# Altium project MacroPlay.PrjPcb
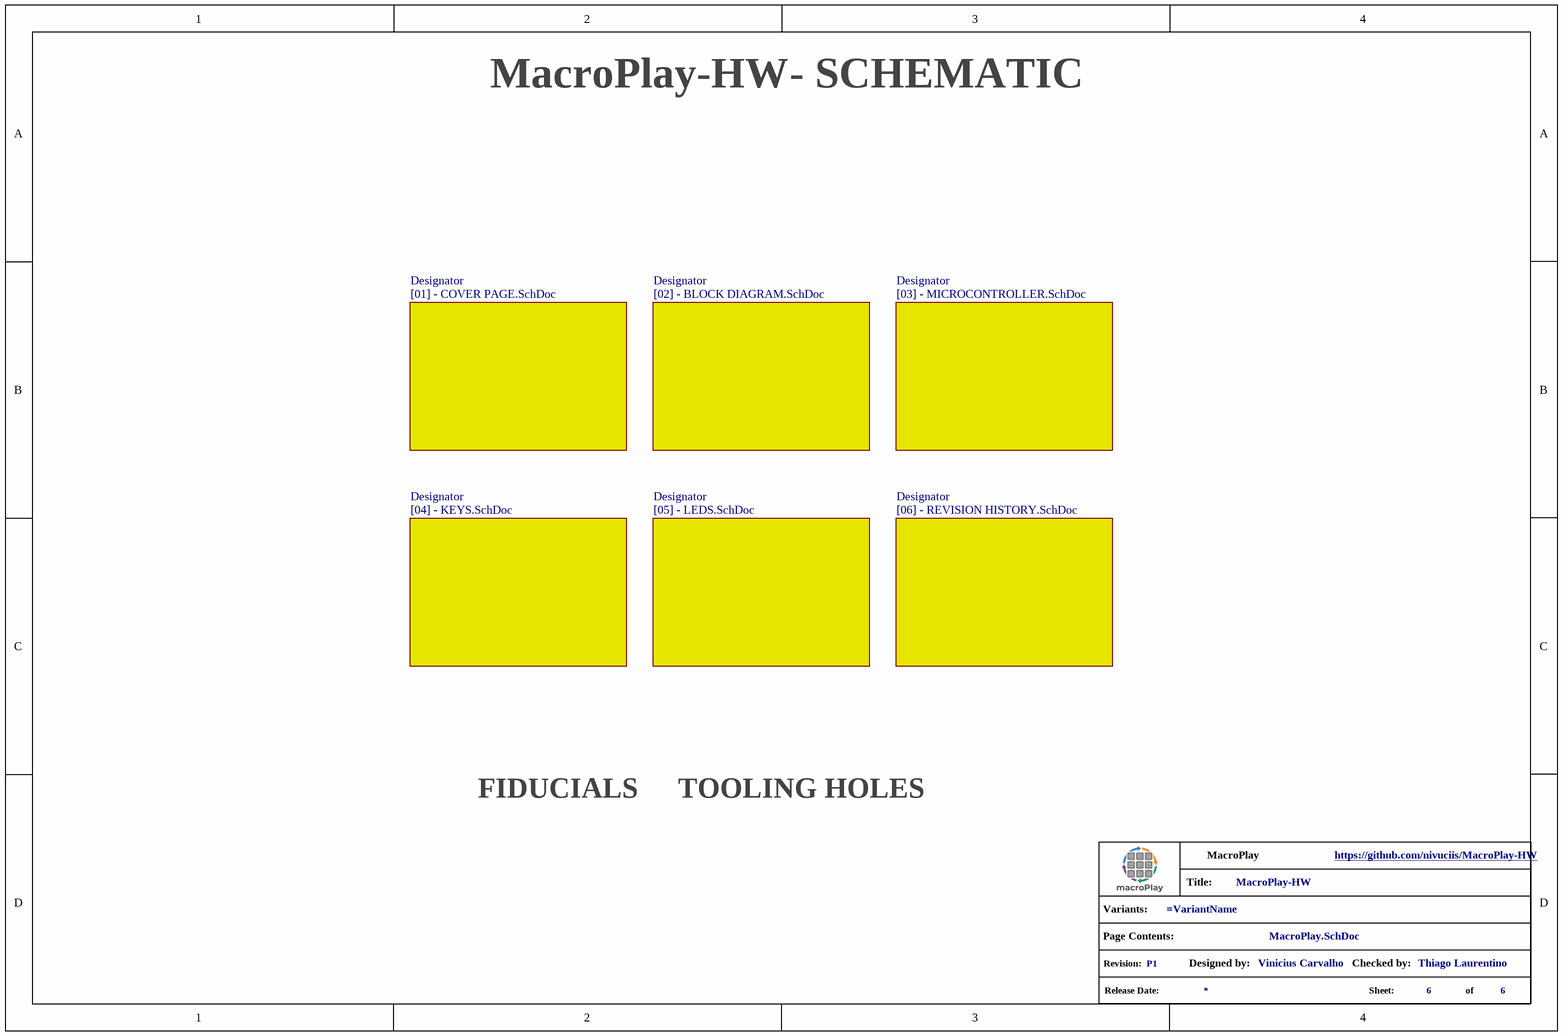
[diagram p0: MacroPlay.SchDoc]
Website: https://github.com/nivuciis/MacroPlay-HW; VersionRevision: P1; TitleProject: MacroPlay-HW; DesignedProject: Vinicius Carvalho; Company: MacroPlay; CheckedProject: Thiago Laurentino
7 sheets, 88 parts. Net scope: flat (ports and power ports of the same name join across sheets).
Board file: MacroPlay.PcbDoc
Sheets:
  MacroPlay.SchDoc
    Designator = [02] - BLOCK DIAGRAM.SchDoc
    Designator = [03] - MICROCONTROLLER.SchDoc
    Designator = [01] - COVER PAGE.SchDoc
    Designator = [06] - REVISION HISTORY.SchDoc
    Designator = [04] - KEYS.SchDoc
    Designator = [05] - LEDS.SchDoc

## Sheet MacroPlay.SchDoc
size A4; DocumentNumber: 6; SheetNumber: 6; SheetTotal: 6

### Parts
(Parts that share a designator on the sheet are numbered #1, #2 ... from top to bottom, then left to right.)
*?#1  info_project  (value not drawn)  (graphical)

### Sub-sheets
Designator = [02] - BLOCK DIAGRAM.SchDoc: no entries
Designator = [03] - MICROCONTROLLER.SchDoc: no entries
Designator = [01] - COVER PAGE.SchDoc: no entries
Designator = [06] - REVISION HISTORY.SchDoc: no entries
Designator = [04] - KEYS.SchDoc: no entries
Designator = [05] - LEDS.SchDoc: no entries

### Notes on the sheet
- - SCHEMATIC
- FIDUCIALS
- TOOLING HOLES
- (in symbol info_project) Title:; Variants:; Page Contents:; Revision:; Designed by:; Checked by:; Release Date:; Sheet:; of

### Library data of the parts
*?#1 = info_project: GRAPHICAL - Info Project

## Sheet [02] - BLOCK DIAGRAM.SchDoc
size A2; DocumentNumber: 2; SheetNumber: 2; SheetTotal: 6; PageSetup: Record=PageOptions|CenterHorizontal=True|CenterVertical=True|PrintScale=0.52|XCorrection=1.00|YCorrection=1.00|PrintKind=1|BorderSize=5000000|LeftOffset=0|BottomOffset=0|Orientation=2|PaperLength=1000|PaperWidth=1000|Scale=100|PaperSource=4|PrintQuality=600|MediaType=1|DitherType=10|PrintScaleMode=1|PaperKind=A4|PaperIndex=9
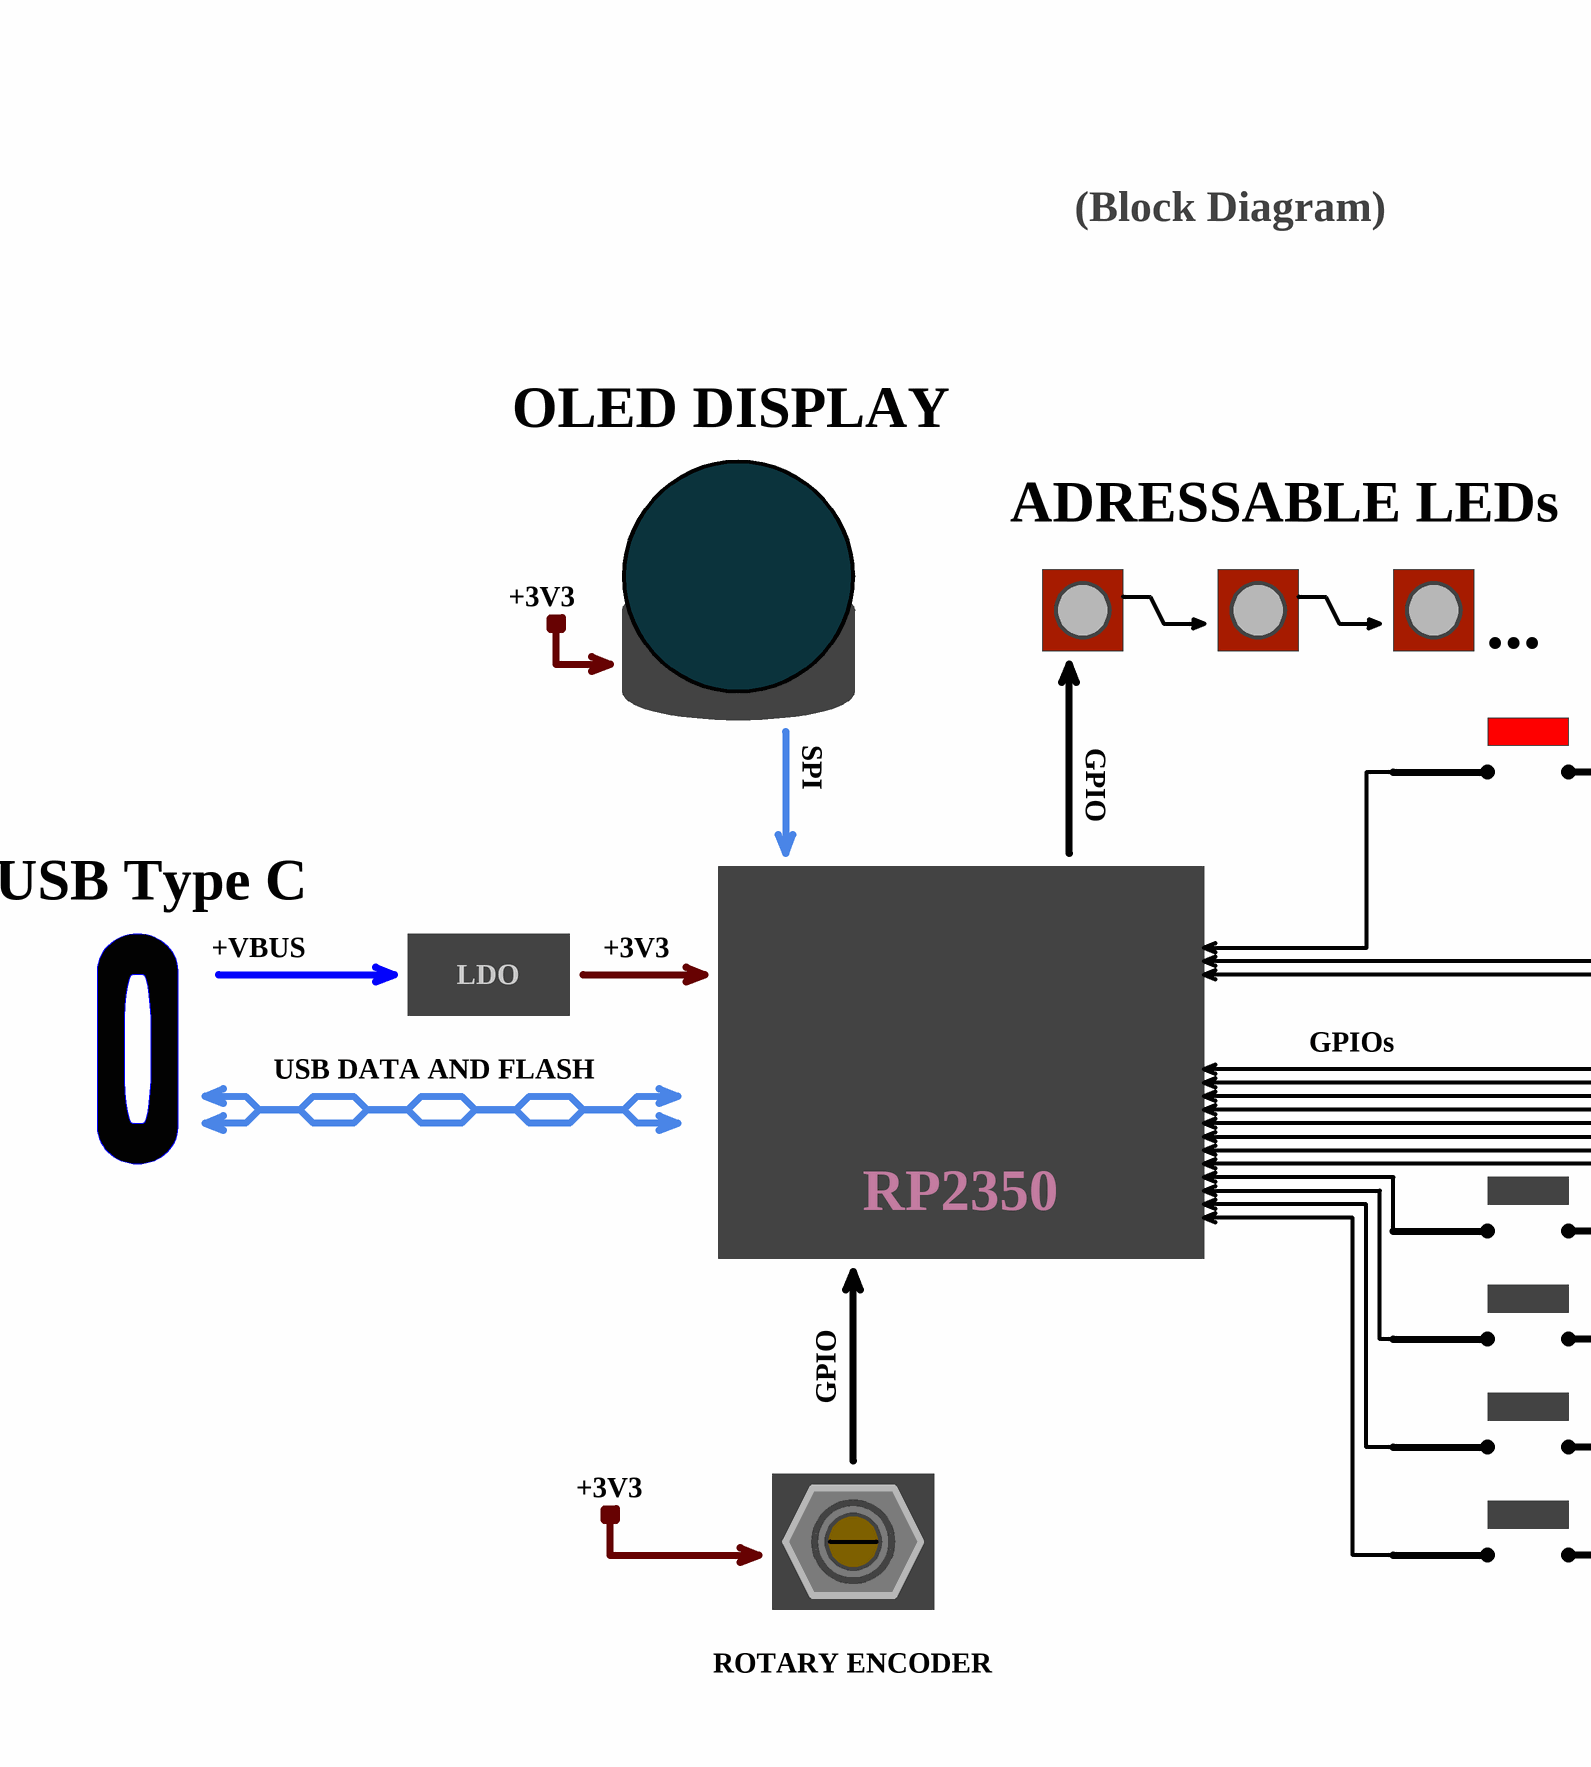
[diagram p1: [02] - BLOCK DIAGRAM.SchDoc, left]
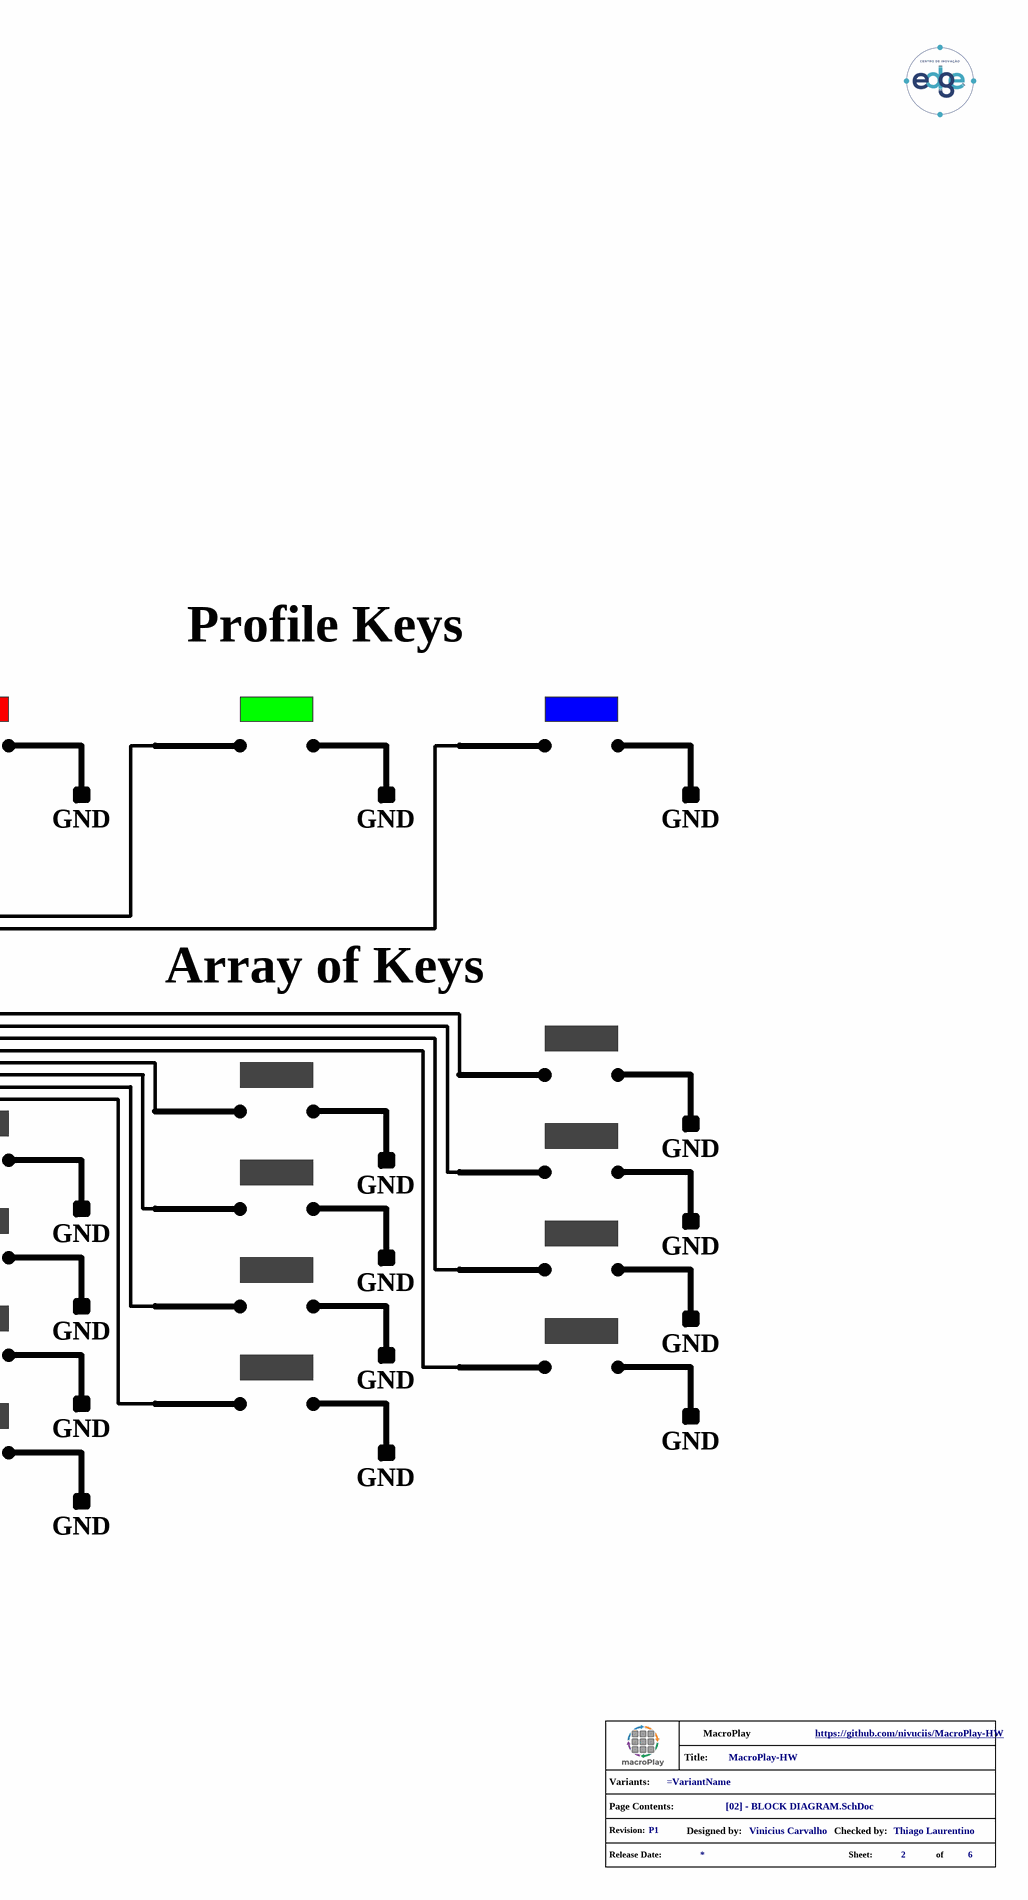
[diagram p2: [02] - BLOCK DIAGRAM.SchDoc, right]

### Parts
(Parts that share a designator on the sheet are numbered #1, #2 ... from top to bottom, then left to right.)
*?#2  info_project  (value not drawn)  (graphical)

### Notes on the sheet
- (Block Diagram)
- OLED DISPLAY
- ADRESSABLE LEDs
- +3V3
- ...
- Profile Keys
- SPI
- GPIO
- GND
- USB Type C
- +VBUS
- LDO
- USB DATA AND FLASH
- GPIOs
- Array of Keys
- RP2350
- ROTARY ENCODER
- (in symbol info_project) Title:; Variants:; Page Contents:; Revision:; Designed by:; Checked by:; Release Date:; Sheet:; of

### Library data of the parts
*?#2 = info_project: GRAPHICAL - Info Project

## Sheet [03] - MICROCONTROLLER.SchDoc
size A4; DocumentNumber: 3; SheetNumber: 3; SheetTotal: 6
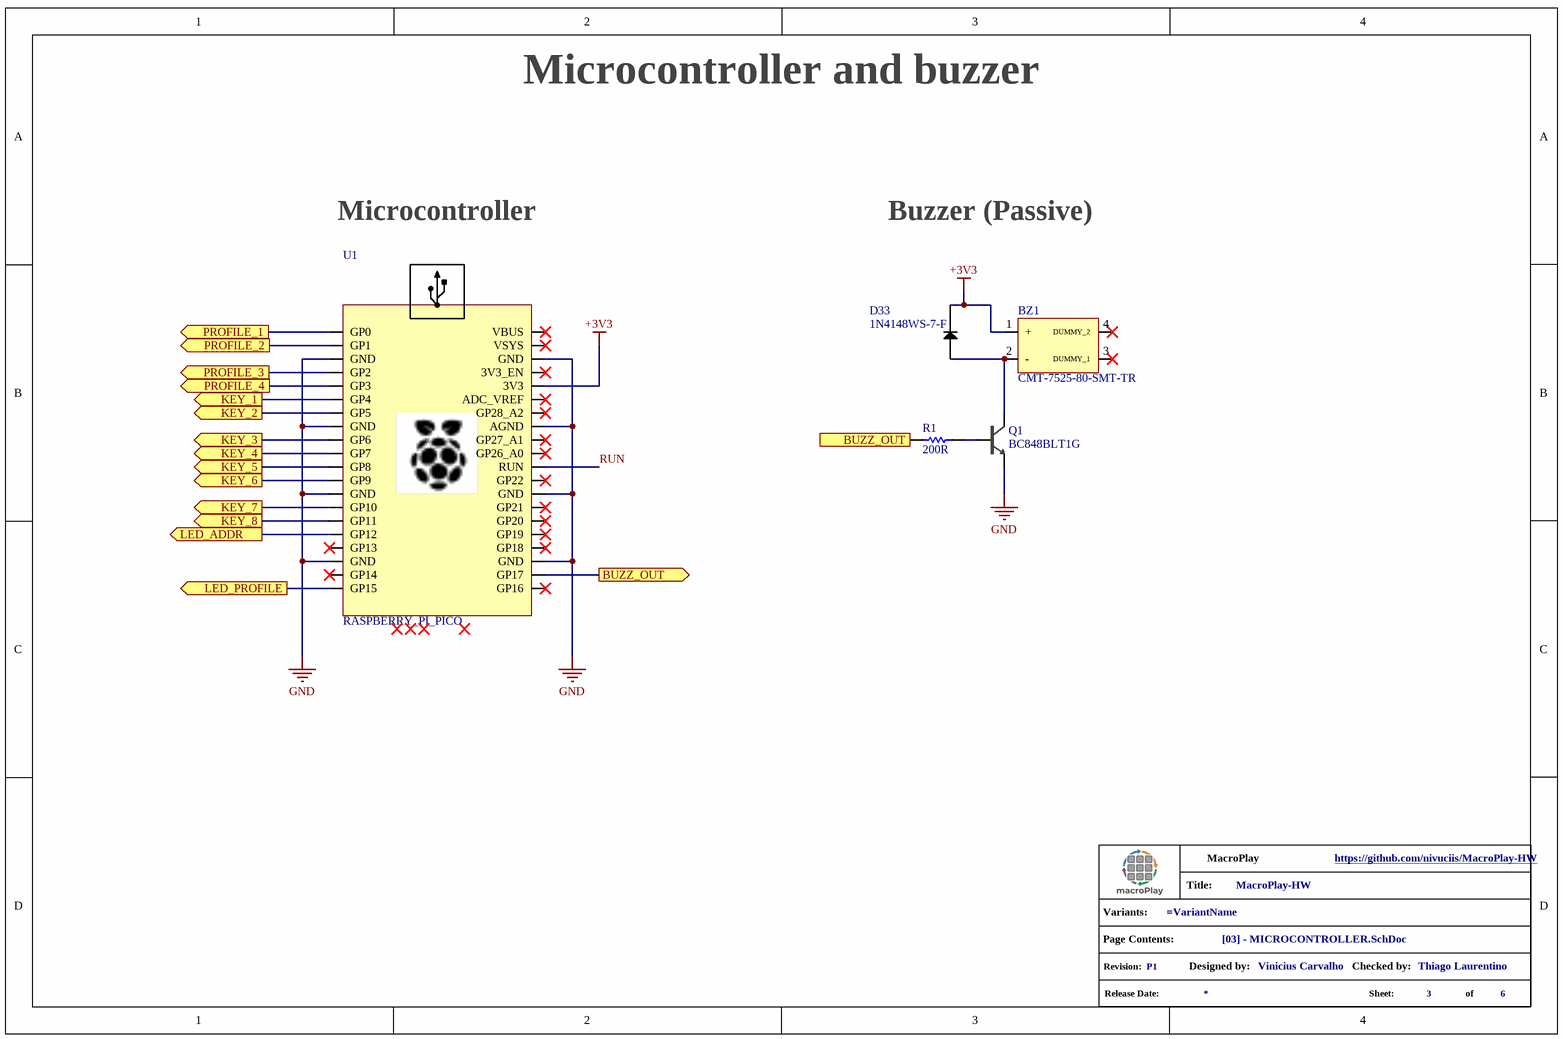
[diagram p3: [03] - MICROCONTROLLER.SchDoc]

### Parts
(Parts that share a designator on the sheet are numbered #1, #2 ... from top to bottom, then left to right.)
*?#3  info_project  (value not drawn)  (graphical)
BZ1  CMT-7525-80-SMT-TR  [CMT752580SMTTR]
D33  1N4148WS-7-F  [SOD2513X120N]
Q1  BC848BLT1G  [SOT-23-3]
R1  200R  [R0402 - IronSolder]
U1  RASPBERRY_PI_PICO  [RASPBERRY_PI_PICO]

### Ports
BUZZ_OUT (in), BUZZ_OUT (out), KEY_1 (out), KEY_2 (out), KEY_3 (out), KEY_4 (out), KEY_5 (out), KEY_6 (out), KEY_7 (out), KEY_8 (out), LED_ADDR (out), LED_PROFILE (out), PROFILE_1 (out), PROFILE_2 (out), PROFILE_3 (out), PROFILE_4 (out)

### Nets
+3V3: BZ1.1(+) D33.1 U1.3V3
GND: Q1.2(Emitter) U1.AGND U1.GND
RUN: U1.RUN
NetBZ1_2: BZ1.2(-) D33.2 Q1.3(Collector)
NetD1#2_4: U1.GP12 ; port LED_ADDR
NetQ1_1: Q1.1(Base) R1.2
NetR1_1: R1.1 U1.GP17 ; port BUZZ_OUT
NetR2_2: U1.GP0 ; port PROFILE_1
NetR3_2: U1.GP1 ; port PROFILE_2
NetR4_2: U1.GP2 ; port PROFILE_3
NetR5_2: U1.GP3 ; port PROFILE_4
NetR6_2: U1.GP4 ; port KEY_1
NetR7_2: U1.GP5 ; port KEY_2
NetR8_2: U1.GP6 ; port KEY_3
NetR9_2: U1.GP7 ; port KEY_4
NetR10_2: U1.GP8 ; port KEY_5
NetR11_2: U1.GP9 ; port KEY_6
NetR12_2: U1.GP10 ; port KEY_7
NetR13_2: U1.GP11 ; port KEY_8
NetU1_GP15: U1.GP15 ; port LED_PROFILE

Not connected (* = marked no-connect by the designer): BZ1 3(DUMMY_1)* 4(DUMMY_2)*; U1 3V3_EN* ADC_VREF* GP13* GP14* GP16* GP18* GP19* GP20* GP21* GP22* GP26_A0* GP27_A1* GP28_A2* VBUS* VSYS*

### Notes on the sheet
- Microcontroller and buzzer
- Microcontroller
- Buzzer (Passive)
- (in symbol info_project) Title:; Variants:; Page Contents:; Revision:; Designed by:; Checked by:; Release Date:; Sheet:; of

### Library data of the parts
*?#3 = info_project: GRAPHICAL - Info Project
BZ1 = CMT-7525-80-SMT-TR: BUZZER - Buzzers Transducer, Externally Driven Magnetic 3.6 V 100mA 2.73kHz 80dB @ 3.6V, 10cm Surface Mount Solder Pads; Manufacturer_Name: Same Sky; Datasheet Link: https://www.sameskydevices.com/product/resource/CMT-7525-80-SMT-TR.pdf; Height: 2.7mm; Manufacturer_Part_Number: CMT-7525-80-SMT-TR; Mouser Part Number: 490-CMT-7525-80SMTTR; Mouser Price/Stock: https://www.mouser.co.uk/ProductDetail/Same-Sky/CMT-7525-80-SMT-TR?qs=P1JMDcb91o5izP7Xira9ww%3D%3D; Arrow Part Number: CMT-7525-80-SMT-TR; Arrow Price/Stock: https://www.arrow.com/en/products/cmt-7525-80-smt-tr/cui-devices?region=nac
D33 = 1N4148WS-7-F: DIODE - Diode 75 V 150mA Surface Mount SOD-323; Manufacturer_Name: Diodes Incorporated; Datasheet Link: https://www.diodes.com//assets/Datasheets/1N4148WS_BAV16WS.pdf; Height: 1.2mm; Manufacturer_Part_Number: 1N4148WS-7-F; Mouser Part Number: 621-1N4148WS-F; Mouser Price/Stock: https://www.mouser.co.uk/ProductDetail/Diodes-Incorporated/1N4148WS-7-F?qs=4drIV0IxA0r8aNy7%2Fu4kVw%3D%3D; Arrow Part Number: 1N4148WS-7-F; Arrow Price/Stock: https://www.arrow.com/en/products/1n4148ws-7-f/diodes-incorporated?utm_currency=USD&region=europe
Q1 = BC848BLT1G: TRANS - NPN 30V 100mA 300mW SOT23-3.; Manufacturer 1: ON Semiconductor; Emitter Base Voltage (VEBO): 5V; Collector Emitter Saturation Voltage: 600mV; Transition Frequency: 100MHz; hFE Min: 200; Number of Elements: 1; Description 1: NPN Ic=100mA Vceo=30V hfe=200~450 P=225mW SOT-23; Category 1: BJTs; .Mounting: SMT; .PCBChecked: Lucas Vieira; Case/Package: SOT-23-3; Pins: 3; Contact Plating: Tin,Matte; Min Operating Temperature: -55°C; Max Operating Temperature: 150°C; Packaging: Tape and Reel; Polarity: NPN; Collector Emitter Breakdown Voltage: 30V; Max Power Dissipation: 300mW; Package Quantity: 3000; Collector Base Voltage (VCBO): 30V; Max Collector Current: 100mA; Max Breakdown Voltage: 30V; Power Dissipation: 300mW; Clock Frequency: 100MHz; Voltage Rating (DC): 30V; Current Rating: 100mA; Collector-emitter Voltage-Max: 600mV; Series: -; Collector Emitter Voltage (VCEO): 30V; Frequency: 100MHz; Gain Bandwidth Product: 100MHz; Length: 2.9mm; Width: 1.3mm; Height: 0.94mm; Radiation Hardening: No; Lead Free: Lead Free; Reach SVHC Compliant: No; RoHS Compliant: Yes; ComponentLink1URL: https://datasheet.ciiva.com/15139/getdatasheetpartid-87781-15139134.pdf?src-supplier=Verical; ComponentLink1Description: https://datasheet.ciiva.com/15139/getdatasheetpartid-87781-15139134.pdf?src-supplier=Verical; ComponentLink2URL: https://datasheet.ciiva.com/7971/bc846alt1-d-7971962.pdf?src-supplier=Element14; ComponentLink2Description: https://datasheet.ciiva.com/7971/bc846alt1-d-7971962.pdf?src-supplier=Element14; ComponentLink3URL: https://datasheet.ciiva.com/7971/bc846alt1-d-7971960.pdf?src-supplier=Element14; ComponentLink3Description: https://datasheet.ciiva.com/7971/bc846alt1-d-7971960.pdf?src-supplier=Element14; ComponentLink4URL: https://datasheet.ciiva.com/11204/bc846alt1-d-11204358.pdf?src-supplier=Avnet; ComponentLink4Description: https://datasheet.ciiva.com/11204/bc846alt1-d-11204358.pdf?src-supplier=Avnet; ComponentLink5URL: https://datasheet.ciiva.com/11198/bc846alt1-d-11198026.pdf?src-supplier=Avnet; ComponentLink5Description: https://datasheet.ciiva.com/11198/bc846alt1-d-11198026.pdf?src-supplier=Avnet; ComponentLink6URL: https://datasheet.ciiva.com/976/bc846alt1-d-976387.pdf?src-supplier=Digi-Key; ComponentLink6Description: https://datasheet.ciiva.com/976/bc846alt1-d-976387.pdf?src-supplier=Digi-Key; ComponentLink7URL: https://datasheet.ciiva.com/976/bc846alt1-d-976388.pdf?src-supplier=Digi-Key; ComponentLink7Description: https://datasheet.ciiva.com/976/bc846alt1-d-976388.pdf?src-supplier=Digi-Key; ComponentLink8URL: https://datasheet.ciiva.com/976/bc846alt1-d-976386.pdf?src-supplier=Digi-Key; ComponentLink8Description: https://datasheet.ciiva.com/976/bc846alt1-d-976386.pdf?src-supplier=Digi-Key; Supplier 1: Digi-Key; Supplier Part Number 1: BC848BLT1GOSCT-ND; Manufacturer Part Number 1: BC848BLT1G; RoHS 1: Yes; Stock 1: 199953; Pricing 1: 1=0,14, 10=0,131, 100=0,0712, 500=0,04384, 1000=0,02989 (USD); Manufacturer 2: ON Semiconductor; Manufacturer Part Number 2: SBC848BLT1G; Manufacturer 3: Nexperia USA Inc.; Manufacturer Part Number 3: BC848B,215; .SCHChecked: Lucas Vieira
R1 = RT0402BRD07200RL: RES - 200R  0.0625W 0402 0.1%  50V Fixed Resistor, Thin Film; Manufacturer 1: Yageo; Additional Feature: HIGH PRECISION; Power: 62.5mW; Rated Temperature: 70°C; Temperature Coefficient (ppm/Cel): 25; Package Height: 0.3mm; Package Length: 1mm; Package Width: 0.5mm; .Mounting: SMT; Supplier: Avnet; Supplier Part Number: 49AK4062; RoHS: Yes; Category: Chip SMD Resistors; Stock: 8493; Pricing: 1=0,198, 25=0,135, 100=0,098, 250=0,087, 500=0,077 (USD); Mounting Technology: Surface Mount; Pins: 2; Case/Package: 0402; Min Operating Temperature: -55°C; Max Operating Temperature: 155°C; Tolerance: 0.1%; Resistor Type: FIXED RESISTOR; Construction: Chip; Packaging: Tape and Reel; Value: 200R; Technology: THIN FILM; Termination: Wraparound; Working Voltage: 50V; Reach SVHC Compliant: Yes; RoHS Compliant: Yes; ComponentLink1URL: https://datasheet.ciiva.com:443/pdfs/VipMasterIC/IC/YAGO/YAGO-S-A0008510989/YAGO-S-A0008510989-1.pdf?src-supplier=IHS+Markit; ComponentLink1Description: https://datasheet.ciiva.com:443/pdfs/VipMasterIC/IC/YAGO/YAGO-S-A0008510989/YAGO-S-A0008510989-1.pdf?src-supplier=IHS+Markit; ComponentLink2URL: https://datasheet.ciiva.com/12705/pyu-rt-1-to-0-05-rohs-l-4-12705967.pdf?src-supplier=Mouser; ComponentLink2Description: https://datasheet.ciiva.com/12705/pyu-rt-1-to-0-05-rohs-l-4-12705967.pdf?src-supplier=Mouser; ComponentLink3URL: https://datasheet.ciiva.com/46635/pyu-rt-1-to-0-05-rohs-l-5-46635174.pdf?src-supplier=Digikey; ComponentLink3Description: https://datasheet.ciiva.com/46635/pyu-rt-1-to-0-05-rohs-l-5-46635174.pdf?src-supplier=Digikey; ComponentLink4URL: https://datasheet.ciiva.com/2582/pyu-rt-1-to-0-05-rohs-l-4-2582220.pdf?src-supplier=Digikey; ComponentLink4Description: https://datasheet.ciiva.com/2582/pyu-rt-1-to-0-05-rohs-l-4-2582220.pdf?src-supplier=Digikey; .SCHChecked: *; .PCBChecked: *; Manufacturer Part Number 1: RT0402BRD07200RL
U1 = RASPBERRY_PI_PICO: MCU Module - Raspberry Pi Board, Arm Cortex-M0+; Core Architecture:Arm; Core Sub-Architecture:Cortex-M0+; Kit Contents:Raspberry Pi Pico Board; No. Of Bits:32Bit; Silicon Core Number:Rp2040; Silicon Manufacturer:Raspberry Pi |Raspberry-Pi RASPBERRY PI PICO; .Mounting: SMD or PTH variant; SnapEDA_Link: https://www.snapeda.com/parts/RASPBERRY%20PI%20PICO/Raspberry+Pi/view-part/?ref=snap; Package: None; Value: *; MF: Raspberry Pi; MP: RASPBERRY PI PICO; Check_prices: https://www.snapeda.com/parts/RASPBERRY%20PI%20PICO/Raspberry+Pi/view-part/?ref=eda; .PCBChecked: *; .SCHChecked: *

## Sheet [01] - COVER PAGE.SchDoc
size A3; DocumentNumber: 1; SheetNumber: 1; SheetTotal: 6
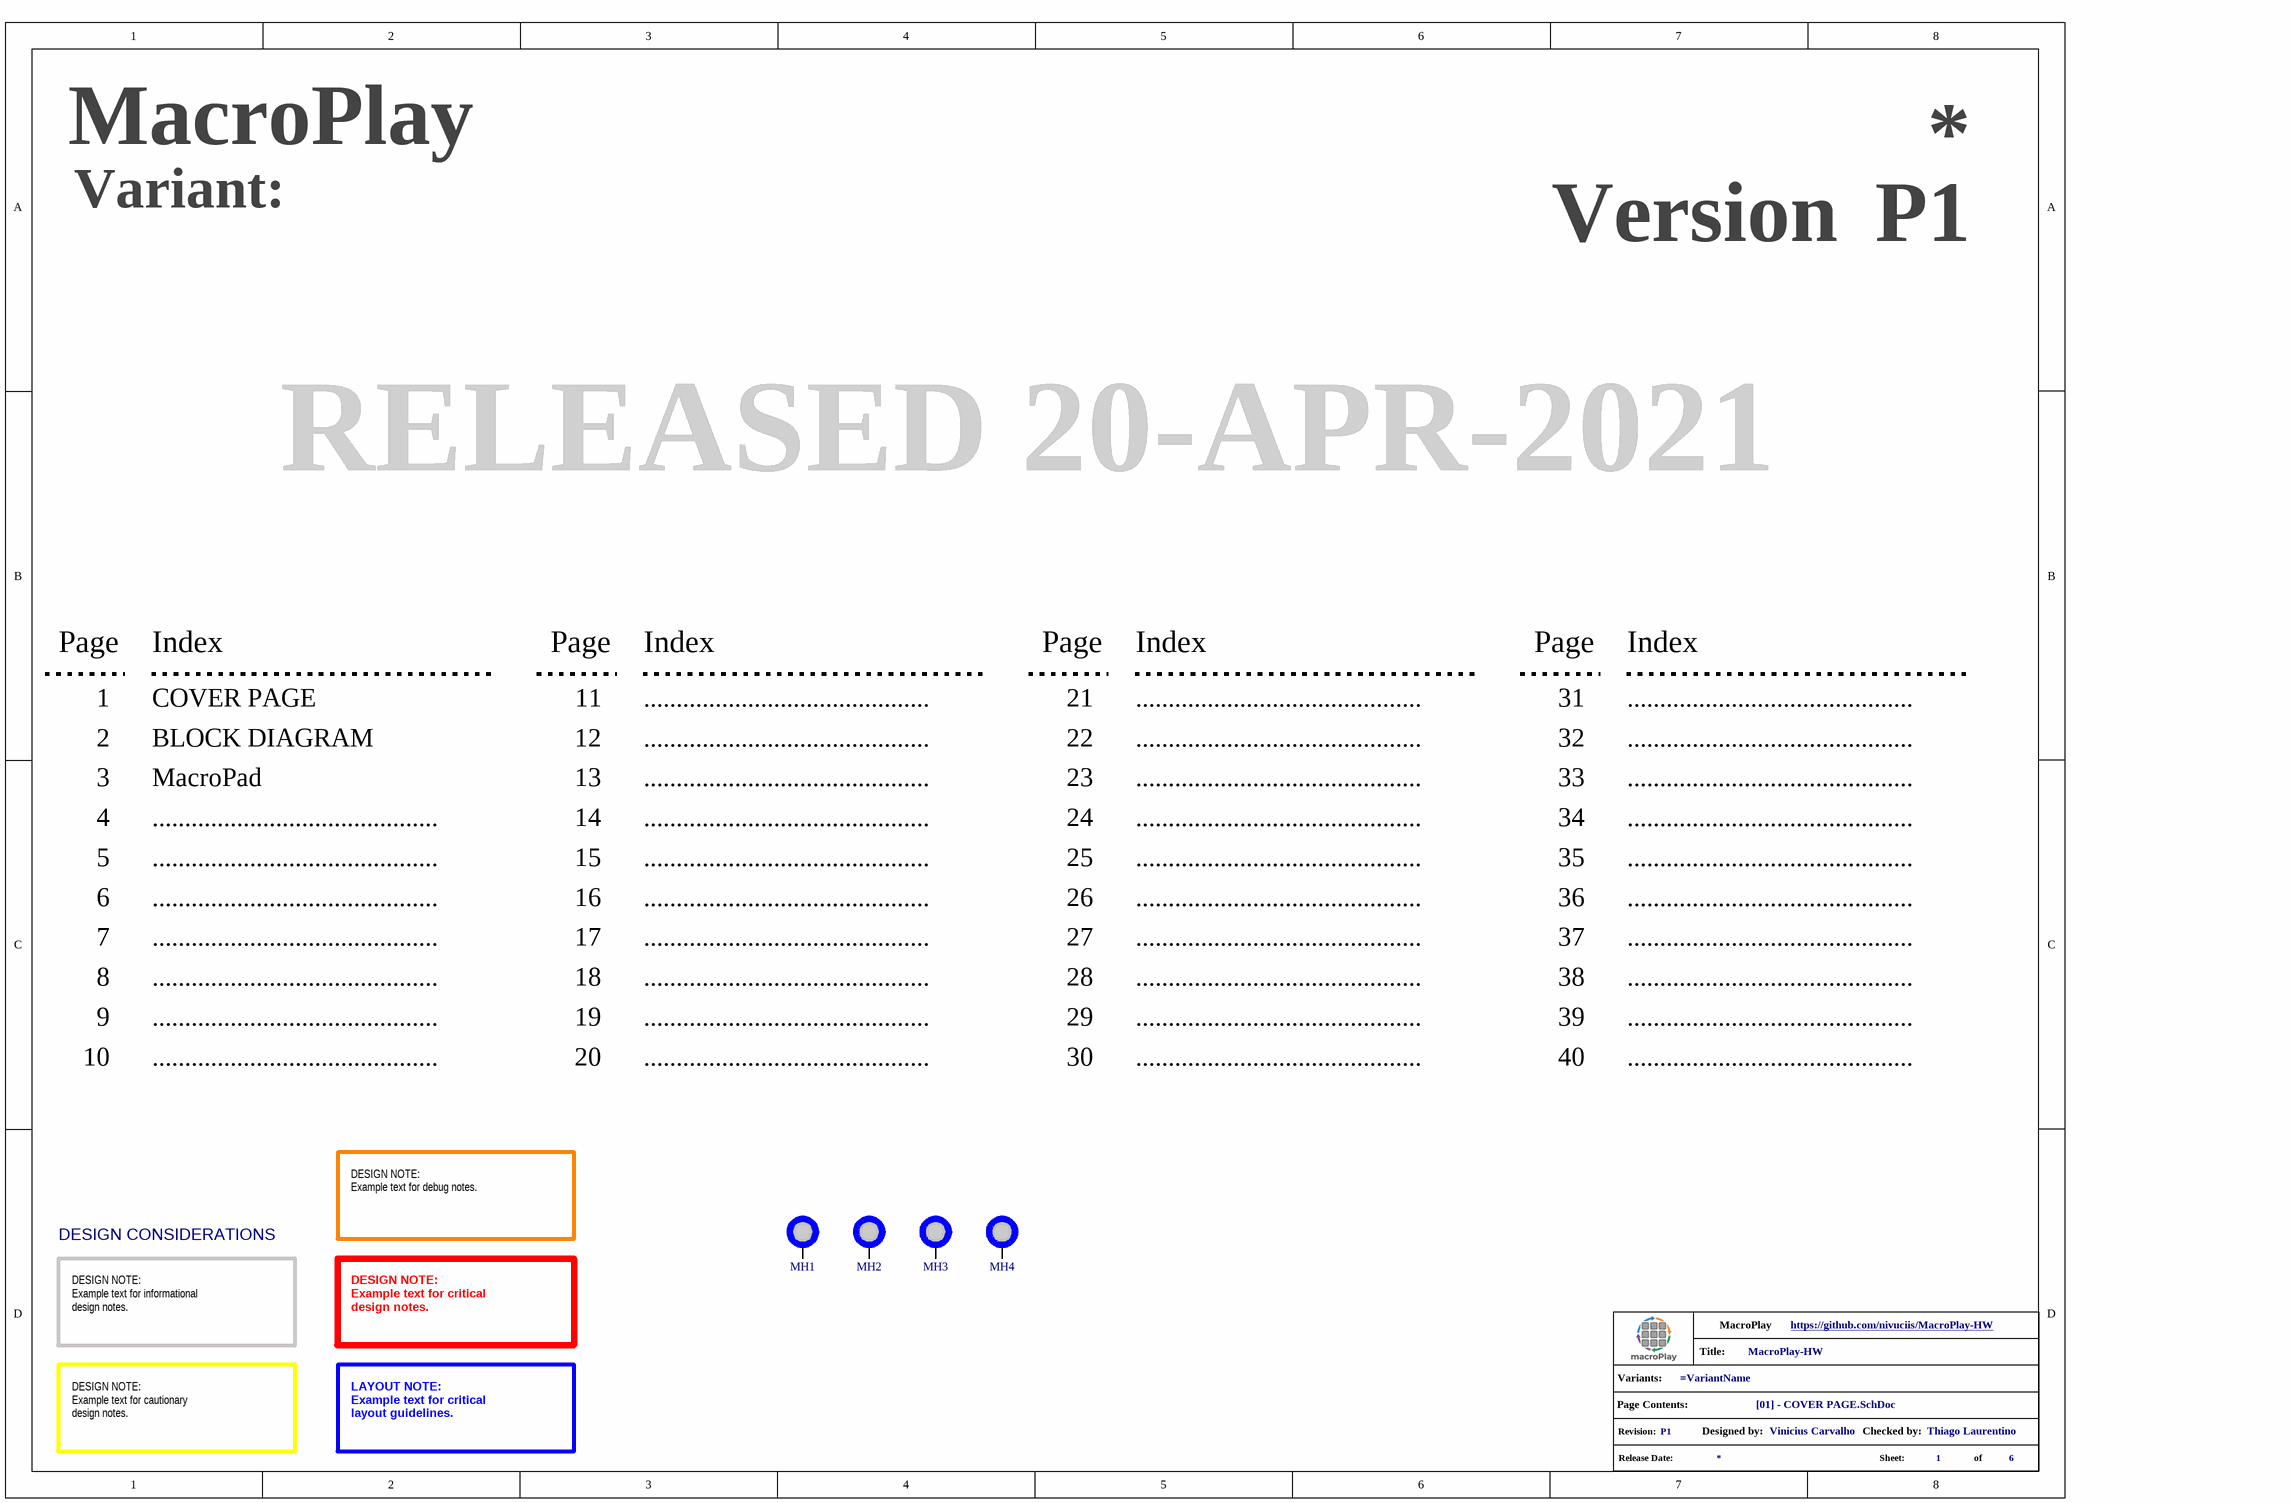
[diagram p4: [01] - COVER PAGE.SchDoc]

### Parts
(Parts that share a designator on the sheet are numbered #1, #2 ... from top to bottom, then left to right.)
*?#4  info_project  (value not drawn)  (graphical)
MH1  MH_7.4MMC_3.2MMD  [MH_7.4MMC_3.2MMD]  (value not drawn)
MH2  MH_7.4MMC_3.2MMD  [MH_7.4MMC_3.2MMD]  (value not drawn)
MH3  MH_7.4MMC_3.2MMD  [MH_7.4MMC_3.2MMD]  (value not drawn)
MH4  MH_7.4MMC_3.2MMD  [MH_7.4MMC_3.2MMD]  (value not drawn)

### Nets

Not connected (* = marked no-connect by the designer): MH1 1; MH2 1; MH3 1; MH4 1

### Notes on the sheet
- MacroPlay
- Variant:
- Version
- RELEASED 20-APR-2021
- Page
- Index
- 1
- COVER PAGE
- 11
- ............................................
- 21
- 31
- 2
- 3
- BLOCK DIAGRAM
- MacroPad
- 12
- 13
- 22
- 23
- 32
- 33
- 4
- 14
- 24
- 34
- 5
- 6
- 15
- 16
- 25
- 26
- 35
- 36
- 7
- 8
- 17
- 18
- 27
- 28
- 37
- 38
- 9
- 19
- 29
- 39
- 10
- 20
- 30
- 40
- DESIGN CONSIDERATIONS
- DESIGN NOTE:
  Example text for debug notes.
- DESIGN NOTE:
  Example text for informational
  design notes.
- DESIGN NOTE:
  Example text for critical
  design notes.
- DESIGN NOTE:
  Example text for cautionary
  design notes.
- LAYOUT NOTE:
  Example text for critical
  layout guidelines.
- (in symbol info_project) Title:; Variants:; Page Contents:; Revision:; Designed by:; Checked by:; Release Date:; Sheet:; of

### Library data of the parts
*?#4 = info_project: GRAPHICAL - Info Project
MH1-MH4 = MH_7.4MMC_3.2MMD: Mounting Hole 7.4mm Diameter 3.2mm Drill

## Sheet [06] - REVISION HISTORY.SchDoc
size A3; DocumentNumber: 5; SheetNumber: 5; SheetTotal: 6
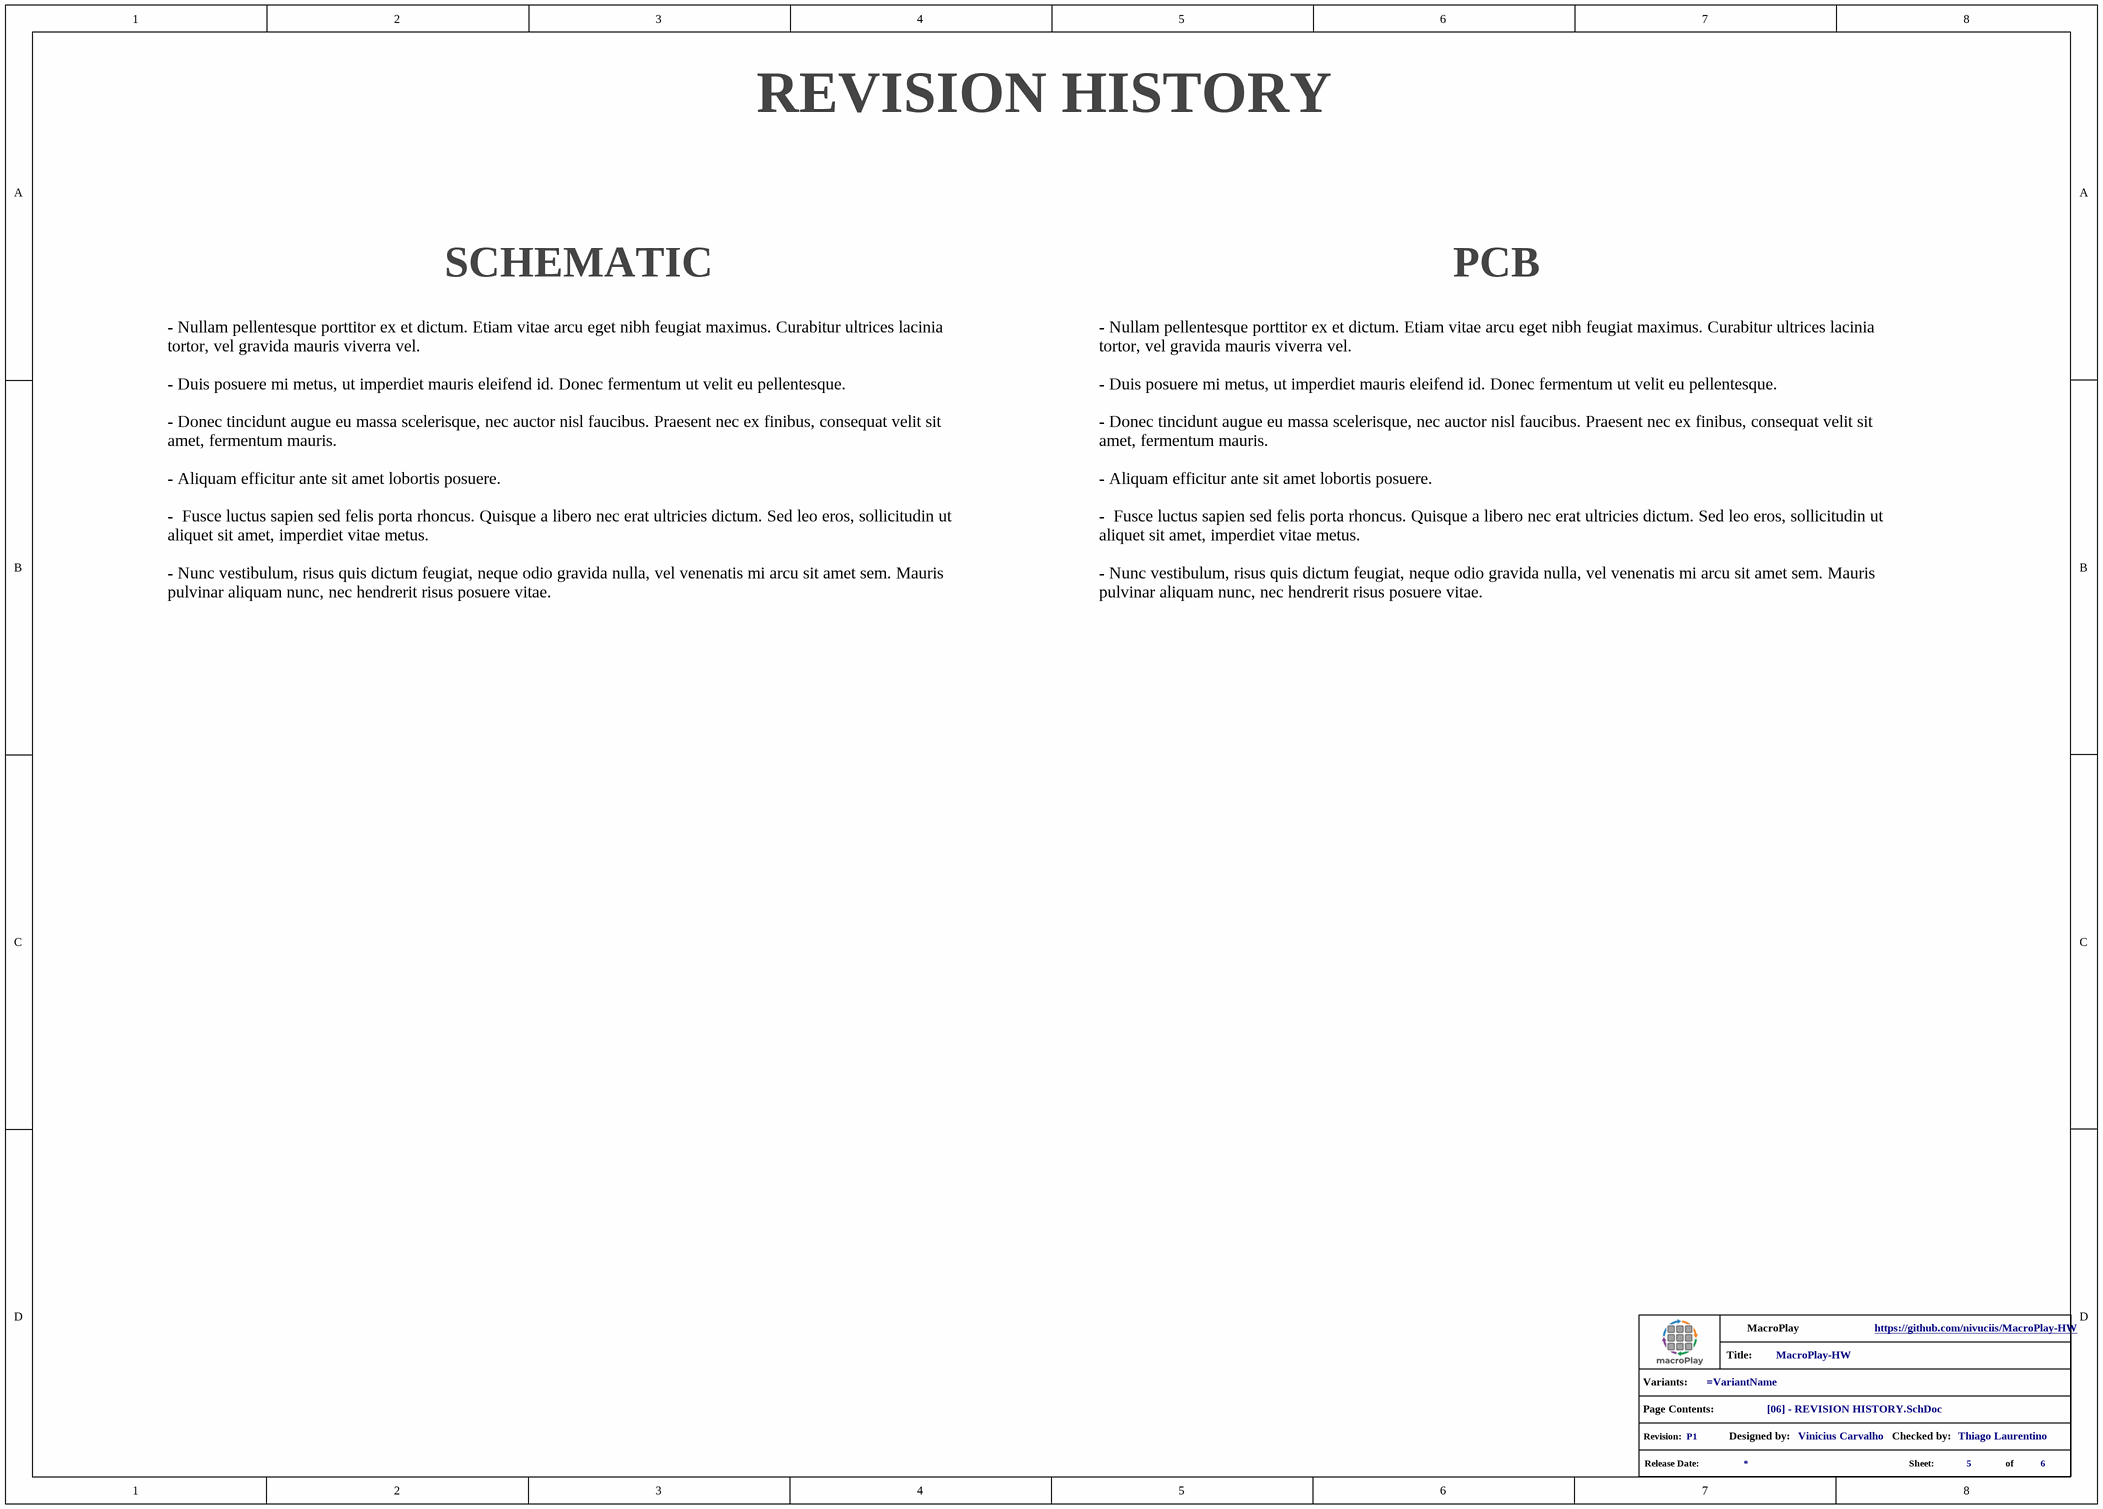
[diagram p5: [06] - REVISION HISTORY.SchDoc]

### Parts
*  info_project  (value not drawn)  (graphical)

### Notes on the sheet
- REVISION HISTORY
- SCHEMATIC
- PCB
- - Nullam pellentesque porttitor ex et dictum. Etiam vitae arcu eget nibh feugiat maximus. Curabitur ultrices lacinia tortor, vel gravida mauris viverra vel.
  - Duis posuere mi metus, ut imperdiet mauris eleifend id. Donec fermentum ut velit eu pellentesque.
  - Donec tincidunt augue eu massa scelerisque, nec auctor nisl faucibus. Praesent nec ex finibus, consequat velit sit amet, fermentum mauris.
  - Aliquam efficitur ante sit amet lobortis posuere.
  -  Fusce luctus sapien sed felis porta rhoncus. Quisque a libero nec erat ultricies dictum. Sed leo eros, sollicitudin ut aliquet sit amet, imperdiet vitae metus.
  - Nunc vestibulum, risus quis dictum feugiat, neque odio gravida nulla, vel venenatis mi arcu sit amet sem. Mauris pulvinar aliquam nunc, nec hendrerit risus posuere vitae.
- (in symbol info_project) Title:; Variants:; Page Contents:; Revision:; Designed by:; Checked by:; Release Date:; Sheet:; of

### Library data of the parts
* = info_project: GRAPHICAL - Info Project

## Sheet [04] - KEYS.SchDoc
size A4
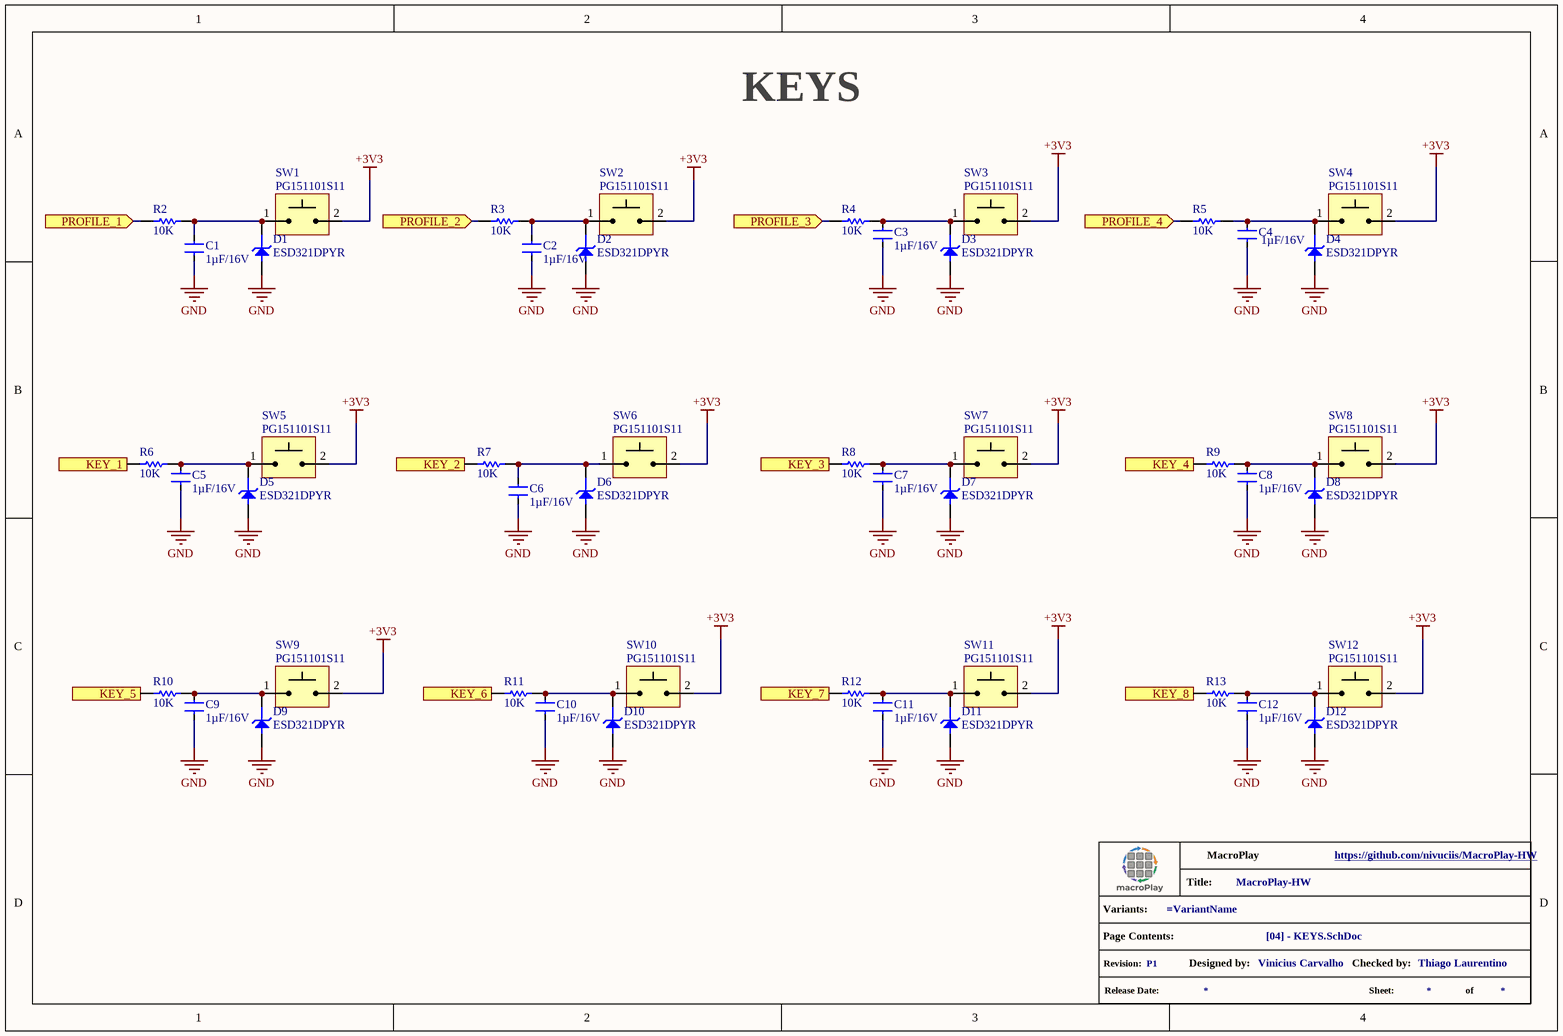
[diagram p6: [04] - KEYS.SchDoc]

### Parts
(Parts that share a designator on the sheet are numbered #1, #2 ... from top to bottom, then left to right.)
C1  1µF/16V  [C0402 - Iron Soldering]
C2  1µF/16V  [C0402 - Iron Soldering]
C3  1µF/16V  [C0402 - Iron Soldering]
C4  1µF/16V  [C0402 - Iron Soldering]
C5  1µF/16V  [C0402 - Iron Soldering]
C6  1µF/16V  [C0402 - Iron Soldering]
C7  1µF/16V  [C0402 - Iron Soldering]
C8  1µF/16V  [C0402 - Iron Soldering]
C9  1µF/16V  [C0402 - Iron Soldering]
C10  1µF/16V  [C0402 - Iron Soldering]
C11  1µF/16V  [C0402 - Iron Soldering]
C12  1µF/16V  [C0402 - Iron Soldering]
D1#1  ESD321DPYR  [ESD321DPYR]
D2#1  ESD321DPYR  [ESD321DPYR]
D3#1  ESD321DPYR  [ESD321DPYR]
D4#1  ESD321DPYR  [ESD321DPYR]
D5#1  ESD321DPYR  [ESD321DPYR]
D6#1  ESD321DPYR  [ESD321DPYR]
D7#1  ESD321DPYR  [ESD321DPYR]
D8#1  ESD321DPYR  [ESD321DPYR]
D9#1  ESD321DPYR  [ESD321DPYR]
D10#1  ESD321DPYR  [ESD321DPYR]
D11#1  ESD321DPYR  [ESD321DPYR]
D12#1  ESD321DPYR  [ESD321DPYR]
GPH?#1  info_project  (value not drawn)  (graphical)
R2  10K  [R0402 - IronSolder]
R3  10K  [R0402 - IronSolder]
R4  10K  [R0402 - IronSolder]
R5  10K  [R0402 - IronSolder]
R6  10K  [R0402 - IronSolder]
R7  10K  [R0402 - IronSolder]
R8  10K  [R0402 - IronSolder]
R9  10K  [R0402 - IronSolder]
R10  10K  [R0402 - IronSolder]
R11  10K  [R0402 - IronSolder]
R12  10K  [R0402 - IronSolder]
R13  10K  [R0402 - IronSolder]
SW1  PG151101S11  [SW_PG151101S11]
SW2  PG151101S11  [SW_PG151101S11]
SW3  PG151101S11  [SW_PG151101S11]
SW4  PG151101S11  [SW_PG151101S11]
SW5  PG151101S11  [SW_PG151101S11]
SW6  PG151101S11  [SW_PG151101S11]
SW7  PG151101S11  [SW_PG151101S11]
SW8  PG151101S11  [SW_PG151101S11]
SW9  PG151101S11  [SW_PG151101S11]
SW10  PG151101S11  [SW_PG151101S11]
SW11  PG151101S11  [SW_PG151101S11]
SW12  PG151101S11  [SW_PG151101S11]

### Ports
KEY_1 (in), KEY_2 (in), KEY_3 (in), KEY_4 (in), KEY_5 (in), KEY_6 (in), KEY_7 (in), KEY_8 (in), PROFILE_1 (in), PROFILE_2 (in), PROFILE_3 (in), PROFILE_4 (in)

### Nets
+3V3: SW1.2 SW2.2 SW3.2 SW4.2 SW5.2 SW6.2 SW7.2 SW8.2 SW9.2 SW10.2 SW11.2 SW12.2
GND: C1.1 C2.1 C3.1 C4.1 C5.1 C6.1 C7.1 C8.1 C9.1 C10.1 C11.1 C12.1 D1#1.2 D2#1.2 D3#1.2 D4#1.2 D5#1.2 D6#1.2 D7#1.2 D8#1.2 D9#1.2 D10#1.2 D11#1.2 D12#1.2
NetC1_2: C1.2 D1#1.1 R2.1 SW1.1
NetC2_2: C2.2 D2#1.1 R3.1 SW2.1
NetC3_2: C3.2 D3#1.1 R4.1 SW3.1
NetC4_2: C4.2 D4#1.1 R5.1 SW4.1
NetC5_2: C5.2 D5#1.1 R6.1 SW5.1
NetC6_2: C6.2 D6#1.1 R7.1 SW6.1
NetC7_2: C7.2 D7#1.1 R8.1 SW7.1
NetC8_2: C8.2 D8#1.1 R9.1 SW8.1
NetC9_2: C9.2 D9#1.1 R10.1 SW9.1
NetC10_2: C10.2 D10#1.1 R11.1 SW10.1
NetC11_2: C11.2 D11#1.1 R12.1 SW11.1
NetC12_2: C12.2 D12#1.1 R13.1 SW12.1
NetR2_2: R2.2 ; port PROFILE_1
NetR3_2: R3.2 ; port PROFILE_2
NetR4_2: R4.2 ; port PROFILE_3
NetR5_2: R5.2 ; port PROFILE_4
NetR6_2: R6.2 ; port KEY_1
NetR7_2: R7.2 ; port KEY_2
NetR8_2: R8.2 ; port KEY_3
NetR9_2: R9.2 ; port KEY_4
NetR10_2: R10.2 ; port KEY_5
NetR11_2: R11.2 ; port KEY_6
NetR12_2: R12.2 ; port KEY_7
NetR13_2: R13.2 ; port KEY_8

### Notes on the sheet
- KEYS
- (in symbol info_project) Title:; Variants:; Page Contents:; Revision:; Designed by:; Checked by:; Release Date:; Sheet:; of

### Library data of the parts
C1-C12 = EMK105BJ105KV-F: MLCC - 1µF 16V 0402 X5R ±10%.; Manufacturer 1: Taiyo Yuden; Dielectric Material: Ceramic; Value: 1uF; Multilayer: Yes; Tolerance  (fill in as +-): 10%; .Mounting: SMT; Supplier 1: Avnet; Supplier Part Number 1: 84R9109; Manufacturer Part Number 1: EMK105BJ105KV-F; RoHS: Yes; Category: Ceramic Capacitors; Stock: 100000; Pricing: 10000=0,007, 20000=0,008 (USD); Mounting Technology: Surface Mount; Pins: 2; Package Shape: Rectangular; Case/Package: 0402; Terminal Finish: Nickel; Min Operating Temperature: -55°C; Max Operating Temperature: 85°C; JESD-609 Code: e3; Capacitor Type: Ceramic; Package Style: SMTMeter; Packaging: Tape and Reel; Tolerance (fill in as +-): 10%; Rated DC Voltage (URdc): 16V; Temperature Characteristics Code: X5R; Termination: Wraparound; Length: 1mm; Width: 0.5mm; Height: 0.5mm; Reach SVHC Compliant: Yes; RoHS Compliant: Yes; ComponentLink1URL: https://datasheet.ciiva.com:443/pdfs/VipMasterIC/IC/TAIY/TAIY-S-A0009096450/TAIY-S-A0009096597-1.pdf?src-supplier=IHS+Markit; ComponentLink1Description: https://datasheet.ciiva.com:443/pdfs/VipMasterIC/IC/TAIY/TAIY-S-A0009096450/TAIY-S-A0009096597-1.pdf?src-supplier=IHS+Markit; ComponentLink2URL: https://datasheet.ciiva.com/134/emk105bj105kv-f-ss-134209.pdf?src-supplier=Digikey; ComponentLink2Description: https://datasheet.ciiva.com/134/emk105bj105kv-f-ss-134209.pdf?src-supplier=Digikey; ComponentLink3URL: https://datasheet.ciiva.com/30259/265emk105bj105kv-f-30259872.pdf?src-supplier=Onlinecomponents.com; ComponentLink3Description: https://datasheet.ciiva.com/30259/265emk105bj105kv-f-30259872.pdf?src-supplier=Onlinecomponents.com; ComponentLink4URL: https://datasheet.ciiva.com/15920/964emk105bj105kv-f-15920402.pdf?src-supplier=Onlinecomponents.com; ComponentLink4Description: https://datasheet.ciiva.com/15920/964emk105bj105kv-f-15920402.pdf?src-supplier=Onlinecomponents.com; ComponentLink5URL: https://datasheet.ciiva.com/26871/getdatasheetpartid-638287-26871289.pdf?src-supplier=Verical; ComponentLink5Description: https://datasheet.ciiva.com/26871/getdatasheetpartid-638287-26871289.pdf?src-supplier=Verical; ComponentLink6URL: https://datasheet.ciiva.com/5424/mlcc01-e-5424190.pdf?src-supplier=Mouser; ComponentLink6Description: https://datasheet.ciiva.com/5424/mlcc01-e-5424190.pdf?src-supplier=Mouser; ComponentLink7URL: https://datasheet.ciiva.com/22694/1497285-22694239.pdf?src-supplier=Element14; ComponentLink7Description: https://datasheet.ciiva.com/22694/1497285-22694239.pdf?src-supplier=Element14; ComponentLink8URL: https://datasheet.ciiva.com/7657/1497285-7657320.pdf?src-supplier=Element14; ComponentLink8Description: https://datasheet.ciiva.com/7657/1497285-7657320.pdf?src-supplier=Element14; .PCBChecked: *; .SCHChecked: *
D1#1 D2#1 D3#1 D4#1 D5#1 D6#1 D7#1 D8#1 D9#1 D10#1 D11#1 D12#1 = ESD321DPYR: DIODE - TVS UNI-DIR 3.6V, 4.5V, 6.8V, 6A, 0.9pF.; Manufacturer 1: Texas Instruments; Description 1: ESD Suppressor Diode TVS Uni-Dir 3.6V 2-Pin X1SON T/R; Category 1: TVS Diodes; .Mouting: SMT; .SCHChecked: Lucas Vieira; RoHS Compliant: Yes; ComponentLink1URL: http://www.ti.com/general/docs/suppproductinfo.tsp?distId=10&amp;gotoUrl=http%3A%2F%2Fwww.ti.com%2Flit%2Fgpn%2Fesd321&src-supplier=Digi-Key; ComponentLink1Description: http://www.ti.com/general/docs/suppproductinfo.tsp?distId=10&amp;gotoUrl=http%3A%2F%2Fwww.ti.com%2Flit%2Fgpn%2Fesd321&src-supplier=Digi-Key; Supplier 1: Digi-Key; Supplier Part Number 1: 296-51108-1-ND; Manufacturer Part Number 1: ESD321DPYR; RoHS 1: Yes; Stock 1: 172519; Pricing 1: 1=0,37000, 10=0,29900, 100=0,20350, 500=0,15264, 1000=0,11448, 2000=0,10494, 5000=0,09858 (USD); Manufacturer 2: Texas Instruments; Manufacturer Part Number 2: ESD351DPYR; .PCBChecked: Lucas Vieira; Manufacturer 3: Panjit International Inc.; Manufacturer Part Number 3: PE1605M1Q_R1_00001; .Mounting: SMT
GPH?#1 = info_project: GRAPHICAL - Info Project
R2-R13 = RC1005F103CS: RES - 10K 1/16W 0402 ±1% Chip Resistor; Manufacturer 1: Samsung; Power: 60mW; Value: 10kR; Working Voltage: 50V; Temperature Coefficient (ppm/Cel): 100; Package Height: 0.35mm; Package Length: 1mm; Package Width: 0.5mm; .Mounting: SMT; Supplier: Digikey; Supplier Part Number: 1276-3431-1-ND; Manufacturer Part Number 1: RC1005F103CS; RoHS: Yes; Category: Chip SMD Resistors; Stock: 10935408; Pricing: 1=0,1, 10=0,039, 100=0,0201, 1000=0,01175, 2500=0,0099, 5000=0,00882 (USD); Mounting Technology: Surface Mount; Pins: 2; Package Shape: Rectangular; Case/Package: 0402; Terminal Finish: Nickel; Min Operating Temperature: -55°C; Max Operating Temperature: 125°C; Tolerance: 1%; JESD-609 Code: e3; Resistor Type: FIXED RESISTOR; Construction: Chip; Packaging: Tape and Reel; Technology: METAL GLAZE/THICK FILM; Reach SVHC Compliant: Yes; RoHS Compliant: Yes; ComponentLink1URL: https://datasheet.ciiva.com:443/pdfs/VipMasterIC/IC/SEMS/SEMS-S-A0001326806/SEMS-S-A0001326806-1.pdf?src-supplier=IHS+Markit; ComponentLink1Description: https://datasheet.ciiva.com:443/pdfs/VipMasterIC/IC/SEMS/SEMS-S-A0001326806/SEMS-S-A0001326806-1.pdf?src-supplier=IHS+Markit; ComponentLink2URL: https://datasheet.ciiva.com/15196/getdatasheetpartid-504789-15196214.pdf?src-supplier=Verical; ComponentLink2Description: https://datasheet.ciiva.com/15196/getdatasheetpartid-504789-15196214.pdf?src-supplier=Verical; ComponentLink3URL: https://datasheet.ciiva.com/16481/rcseries-16481007.pdf?src-supplier=Future+Electronics; ComponentLink3Description: https://datasheet.ciiva.com/16481/rcseries-16481007.pdf?src-supplier=Future+Electronics; .PCBChecked: *; .SCHChecked: *
SW1-SW12 = PG151101S11: SWITCH - Kailh socket for hotswap mechanical switches; .Mounting: SMD; SnapEDA_Link: https://www.snapeda.com/parts/PG151101S11/Kailh/view-part/?ref=snap; Package: Package; Value: *; MF: Kailh; MP: PG151101S11; Check_prices: https://www.snapeda.com/parts/PG151101S11/Kailh/view-part/?ref=eda; .PCBChecked: *; .SCHChecked: *

## Sheet [05] - LEDS.SchDoc
size A4
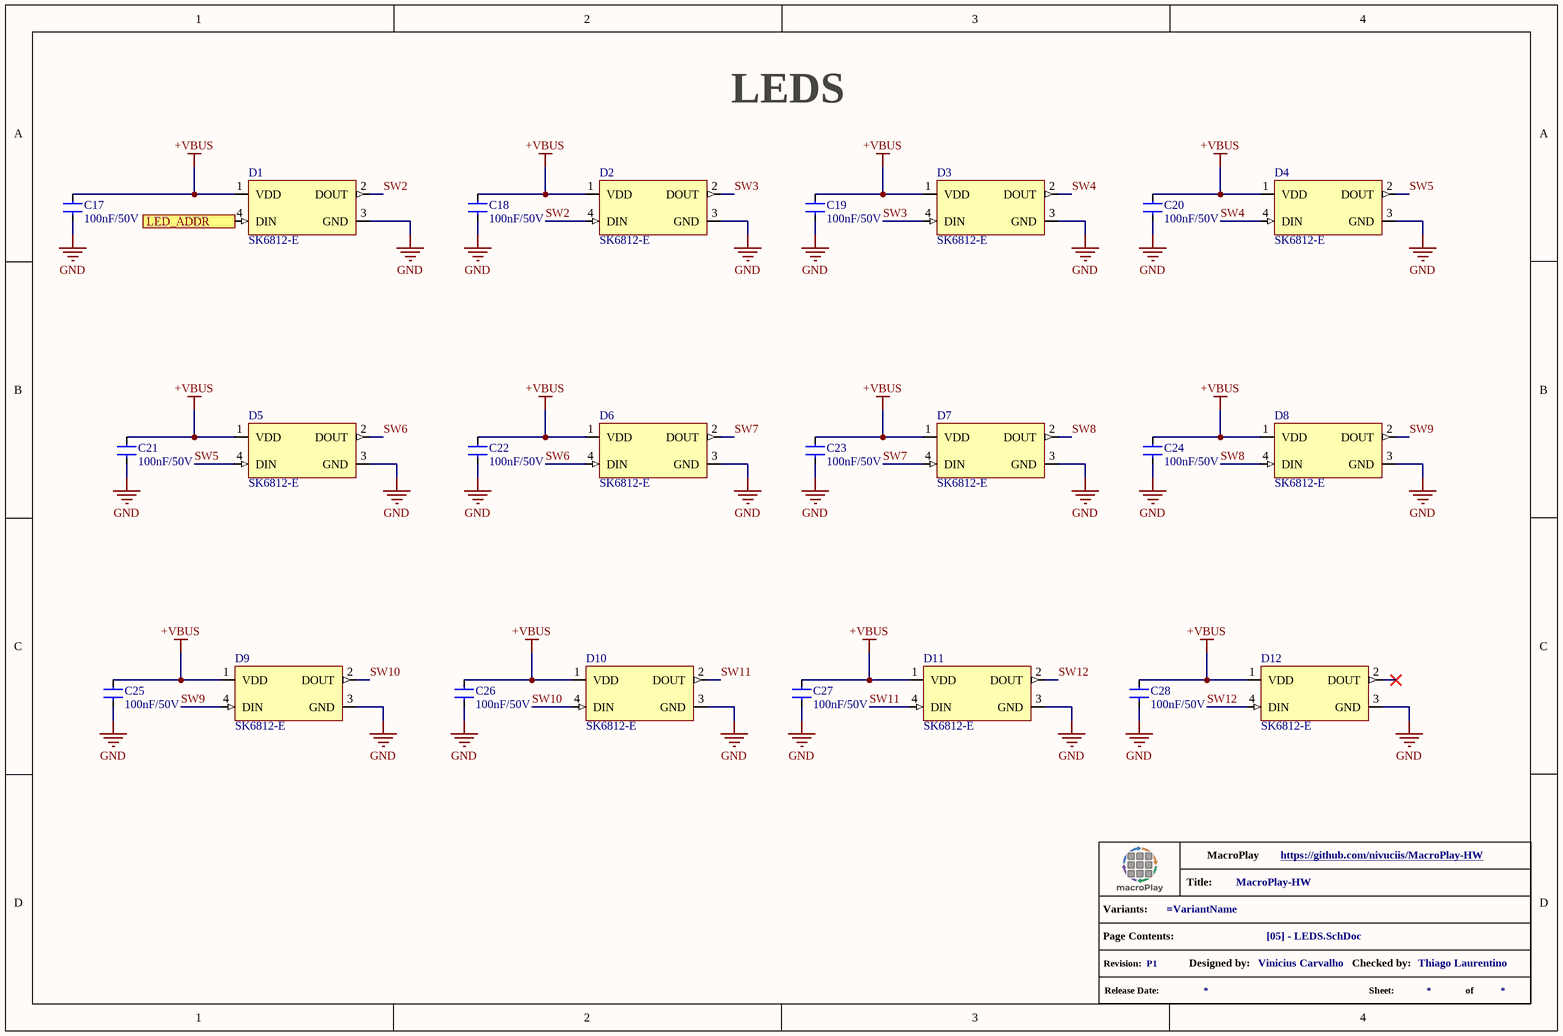
[diagram p7: [05] - LEDS.SchDoc]

### Parts
(Parts that share a designator on the sheet are numbered #1, #2 ... from top to bottom, then left to right.)
C17  100nF/50V  [C0805 - ironsoldering]
C18  100nF/50V  [C0805 - ironsoldering]
C19  100nF/50V  [C0805 - ironsoldering]
C20  100nF/50V  [C0805 - ironsoldering]
C21  100nF/50V  [C0805 - ironsoldering]
C22  100nF/50V  [C0805 - ironsoldering]
C23  100nF/50V  [C0805 - ironsoldering]
C24  100nF/50V  [C0805 - ironsoldering]
C25  100nF/50V  [C0805 - ironsoldering]
C26  100nF/50V  [C0805 - ironsoldering]
C27  100nF/50V  [C0805 - ironsoldering]
C28  100nF/50V  [C0805 - ironsoldering]
D1#2  SK6812-E  [LED_SK6812-E]
D2#2  SK6812-E  [LED_SK6812-E]
D3#2  SK6812-E  [LED_SK6812-E]
D4#2  SK6812-E  [LED_SK6812-E]
D5#2  SK6812-E  [LED_SK6812-E]
D6#2  SK6812-E  [LED_SK6812-E]
D7#2  SK6812-E  [LED_SK6812-E]
D8#2  SK6812-E  [LED_SK6812-E]
D9#2  SK6812-E  [LED_SK6812-E]
D10#2  SK6812-E  [LED_SK6812-E]
D11#2  SK6812-E  [LED_SK6812-E]
D12#2  SK6812-E  [LED_SK6812-E]
GPH?#2  info_project  (value not drawn)  (graphical)

### Ports
LED_ADDR (in)

### Nets
+VBUS: C17.2 C18.2 C19.2 C20.2 C21.2 C22.2 C23.2 C24.2 C25.2 C26.2 C27.2 C28.2 D1#2.1(VDD) D2#2.1(VDD) D3#2.1(VDD) D4#2.1(VDD) D5#2.1(VDD) D6#2.1(VDD) D7#2.1(VDD) D8#2.1(VDD) D9#2.1(VDD) D10#2.1(VDD) D11#2.1(VDD) D12#2.1(VDD)
GND: C17.1 C18.1 C19.1 C20.1 C21.1 C22.1 C23.1 C24.1 C25.1 C26.1 C27.1 C28.1 D1#2.3(GND) D2#2.3(GND) D3#2.3(GND) D4#2.3(GND) D5#2.3(GND) D6#2.3(GND) D7#2.3(GND) D8#2.3(GND) D9#2.3(GND) D10#2.3(GND) D11#2.3(GND) D12#2.3(GND)
SW2: D1#2.2(DOUT) D2#2.4(DIN)
SW3: D2#2.2(DOUT) D3#2.4(DIN)
SW4: D3#2.2(DOUT) D4#2.4(DIN)
SW5: D4#2.2(DOUT) D5#2.4(DIN)
SW6: D5#2.2(DOUT) D6#2.4(DIN)
SW7: D6#2.2(DOUT) D7#2.4(DIN)
SW8: D7#2.2(DOUT) D8#2.4(DIN)
SW9: D8#2.2(DOUT) D9#2.4(DIN)
SW10: D9#2.2(DOUT) D10#2.4(DIN)
SW11: D10#2.2(DOUT) D11#2.4(DIN)
SW12: D11#2.2(DOUT) D12#2.4(DIN)
NetD1#2_4: D1#2.4(DIN) ; port LED_ADDR

Not connected (* = marked no-connect by the designer): D12#2 2(DOUT)*

### Notes on the sheet
- LEDS
- (in symbol info_project) Title:; Variants:; Page Contents:; Revision:; Designed by:; Checked by:; Release Date:; Sheet:; of

### Library data of the parts
C17-C28 = CL21B104KBCNNNC: MLCC - 100nF 50V X7R 0805 ±10%; Manufacturer: Samsung Electro-Mechanics; Dielectric Material: Ceramic; .Mounting: SMD; Supplier: Future Electronics; Supplier Part Number: CL21B104KBCNNNC; Manufacturer Part Number: CL21B104KBCNNNC; RoHS: Compliant; Category: Ceramic Capacitors; Stock: 6136000; Pricing: 4000=0,0059, 16000=0,0057, 60000=0,0055, 100000=0,0054, 200000=0,0052 (USD); Value: 100nF; Case/Package: 0805; Case Code (Imperial): 0805; Case Code (Metric): 2012; China RoHS: Compliant; Contact Plating: Tin; Country of Origin: Mainland China, Philippines, South Korea; Depth: 1.25mm; Dielectric: X7R; Export Control Classification Number (ECCN) Code: EAR99; Height: 950µm; Harmonized Tariff Schedule (HTS) Code: 8532.24.00.20; Introduction Date: 2009-07-27; Lead Free: Lead Free; Length: 2mm; Lifecycle Status: Production; Material: Ceramic; Max Operating Temperature: 125°C; Min Operating Temperature: -55°C; Mounting Technology: Surface Mount; Number of Terminals: 2; Radiation Hardening: No; REACH SVHC: Yes; Schedule B: 8532240020, 8532240020|8532240020, 8532240020|8532240020|8532240020, 8532240020|8532240020|8532240020|8532240020; Thickness: 939.8µm; Tolerance: 10%; Voltage: 50V; Voltage Rating: 50V; Voltage Rating (DC): 50V; Width: 1.25mm; ComponentLink1URL: https://datasheet.octopart.com:443/CL21B104KBCNNNC-Samsung-Electro-Mechanics-datasheet-137745078.pdf?src-supplier=IHS; ComponentLink1Description: https://datasheet.octopart.com:443/CL21B104KBCNNNC-Samsung-Electro-Mechanics-datasheet-137745078.pdf?src-supplier=IHS; ComponentLink2URL: https://datasheet.octopart.com/CL21B104KBCNNNC-Samsung-Electro-Mechanics-datasheet-8324245.pdf; ComponentLink2Description: https://datasheet.octopart.com/CL21B104KBCNNNC-Samsung-Electro-Mechanics-datasheet-8324245.pdf; ComponentLink3URL: https://datasheet.octopart.com/CL21B104KBCNNNC-Samsung-Electro-Mechanics-datasheet-97040617.pdf; ComponentLink3Description: https://datasheet.octopart.com/CL21B104KBCNNNC-Samsung-Electro-Mechanics-datasheet-97040617.pdf; ComponentLink4URL: https://datasheet.octopart.com/General-Multilayer-Ceramic-Capacitors-Samsung-datasheet-family-111.pdf; ComponentLink4Description: https://datasheet.octopart.com/General-Multilayer-Ceramic-Capacitors-Samsung-datasheet-family-111.pdf; ComponentLink5URL: https://datasheet.octopart.com:443/CL21B104KBCNNNC-Samsung-Electro-Mechanics-datasheet-11548950.pdf?src-supplier=Future+Electronics; ComponentLink5Description: https://datasheet.octopart.com:443/CL21B104KBCNNNC-Samsung-Electro-Mechanics-datasheet-11548950.pdf?src-supplier=Future+Electronics; ComponentLink6URL: https://datasheet.octopart.com:443/CL21B104KBCNNNC-Samsung-Electro-Mechanics-datasheet-116891032.pdf?src-supplier=Future+Electronics; ComponentLink6Description: https://datasheet.octopart.com:443/CL21B104KBCNNNC-Samsung-Electro-Mechanics-datasheet-116891032.pdf?src-supplier=Future+Electronics; ComponentLink7URL: https://datasheet.octopart.com:443/CL21B104KBCNNNC-Samsung-Electro-Mechanics-datasheet-81462175.pdf?src-supplier=Future+Electronics; ComponentLink7Description: https://datasheet.octopart.com:443/CL21B104KBCNNNC-Samsung-Electro-Mechanics-datasheet-81462175.pdf?src-supplier=Future+Electronics; ComponentLink8URL: https://datasheet.octopart.com:443/CL21B104KBCNNNC-Samsung-datasheet-42485244.pdf?src-supplier=Future+Electronics; ComponentLink8Description: https://datasheet.octopart.com:443/CL21B104KBCNNNC-Samsung-datasheet-42485244.pdf?src-supplier=Future+Electronics; ComponentLink9URL: https://datasheet.octopart.com:443/CL21B104KBCNNNC-Samsung-Electro-Mechanics-datasheet-149045937.pdf?src-supplier=Future+Electronics; ComponentLink9Description: https://datasheet.octopart.com:443/CL21B104KBCNNNC-Samsung-Electro-Mechanics-datasheet-149045937.pdf?src-supplier=Future+Electronics; ComponentLink10URL: https://datasheet.octopart.com:443/CL21B104KBCNNNC-Samsung-datasheet-8326407.pdf?src-supplier=TME; ComponentLink10Description: https://datasheet.octopart.com:443/CL21B104KBCNNNC-Samsung-datasheet-8326407.pdf?src-supplier=TME; ComponentLink11URL: http://sigma.octopart.com:80/rohs_certificate/General-Multilayer-Ceramic-Capacitors-Samsung-family-110.pdf?src-supplier=Compliance+Statements; ComponentLink11Description: http://sigma.octopart.com:80/rohs_certificate/General-Multilayer-Ceramic-Capacitors-Samsung-family-110.pdf?src-supplier=Compliance+Statements; ComponentLink12URL: http://sigma.octopart.com:80/rohs_statement/General-Multilayer-Ceramic-Capacitors-Samsung-family-132.pdf?src-supplier=Compliance+Statements; ComponentLink12Description: http://sigma.octopart.com:80/rohs_statement/General-Multilayer-Ceramic-Capacitors-Samsung-family-132.pdf?src-supplier=Compliance+Statements; ComponentLink13URL: http://sigma.octopart.com:80/reach_statement/General-Multilayer-Ceramic-Capacitors-Samsung-family-133.pdf?src-supplier=Compliance+Statements; ComponentLink13Description: http://sigma.octopart.com:80/reach_statement/General-Multilayer-Ceramic-Capacitors-Samsung-family-133.pdf?src-supplier=Compliance+Statements; .SCHChecked: *; .PCBChecked: *
D1#2 D2#2 D3#2 D4#2 D5#2 D6#2 D7#2 D8#2 D9#2 D10#2 D11#2 D12#2 = SK6812-E: DIODE - SK6812MINI-E is a smart LED control circuit and light emitting circuit in one controlled LED source, which has the shape of a 3528 LED chip.; MF: DONGGUANG OPSCO OPTOELECTRONICS CO., LTD; SnapEDA_Link: https://www.snapeda.com/parts/SK6812-E/DONGGUANG+OPSCO+OPTOELECTRONICS+CO.%252C+LTD/view-part/?ref=snap; Package: Package; Value: *; MP: SK6812-E; Check_prices: https://www.snapeda.com/parts/SK6812-E/DONGGUANG+OPSCO+OPTOELECTRONICS+CO.%252C+LTD/view-part/?ref=eda
GPH?#2 = info_project: GRAPHICAL - Info Project

## Nets that join several sheets
+3V3: [03] - MICROCONTROLLER (BZ1.1 D33.1 U1.3V3), [04] - KEYS (12 pins)
GND: [03] - MICROCONTROLLER (Q1.2 U1.AGND U1.GND), [04] - KEYS (24 pins), [05] - LEDS (24 pins)
NetD1#2_4: [03] - MICROCONTROLLER (U1.GP12), [05] - LEDS (D1#2.4)
NetR2_2: [03] - MICROCONTROLLER (U1.GP0), [04] - KEYS (R2.2)
NetR3_2: [03] - MICROCONTROLLER (U1.GP1), [04] - KEYS (R3.2)
NetR4_2: [03] - MICROCONTROLLER (U1.GP2), [04] - KEYS (R4.2)
NetR5_2: [03] - MICROCONTROLLER (U1.GP3), [04] - KEYS (R5.2)
NetR6_2: [03] - MICROCONTROLLER (U1.GP4), [04] - KEYS (R6.2)
NetR7_2: [03] - MICROCONTROLLER (U1.GP5), [04] - KEYS (R7.2)
NetR8_2: [03] - MICROCONTROLLER (U1.GP6), [04] - KEYS (R8.2)
NetR9_2: [03] - MICROCONTROLLER (U1.GP7), [04] - KEYS (R9.2)
NetR10_2: [03] - MICROCONTROLLER (U1.GP8), [04] - KEYS (R10.2)
NetR11_2: [03] - MICROCONTROLLER (U1.GP9), [04] - KEYS (R11.2)
NetR12_2: [03] - MICROCONTROLLER (U1.GP10), [04] - KEYS (R12.2)
NetR13_2: [03] - MICROCONTROLLER (U1.GP11), [04] - KEYS (R13.2)

## Assembly variants
PROTOTYPE: all parts fitted
PRODUCTION: all parts fitted